# EAGLE schematic rt1_handle (EAGLE 6.6.0)
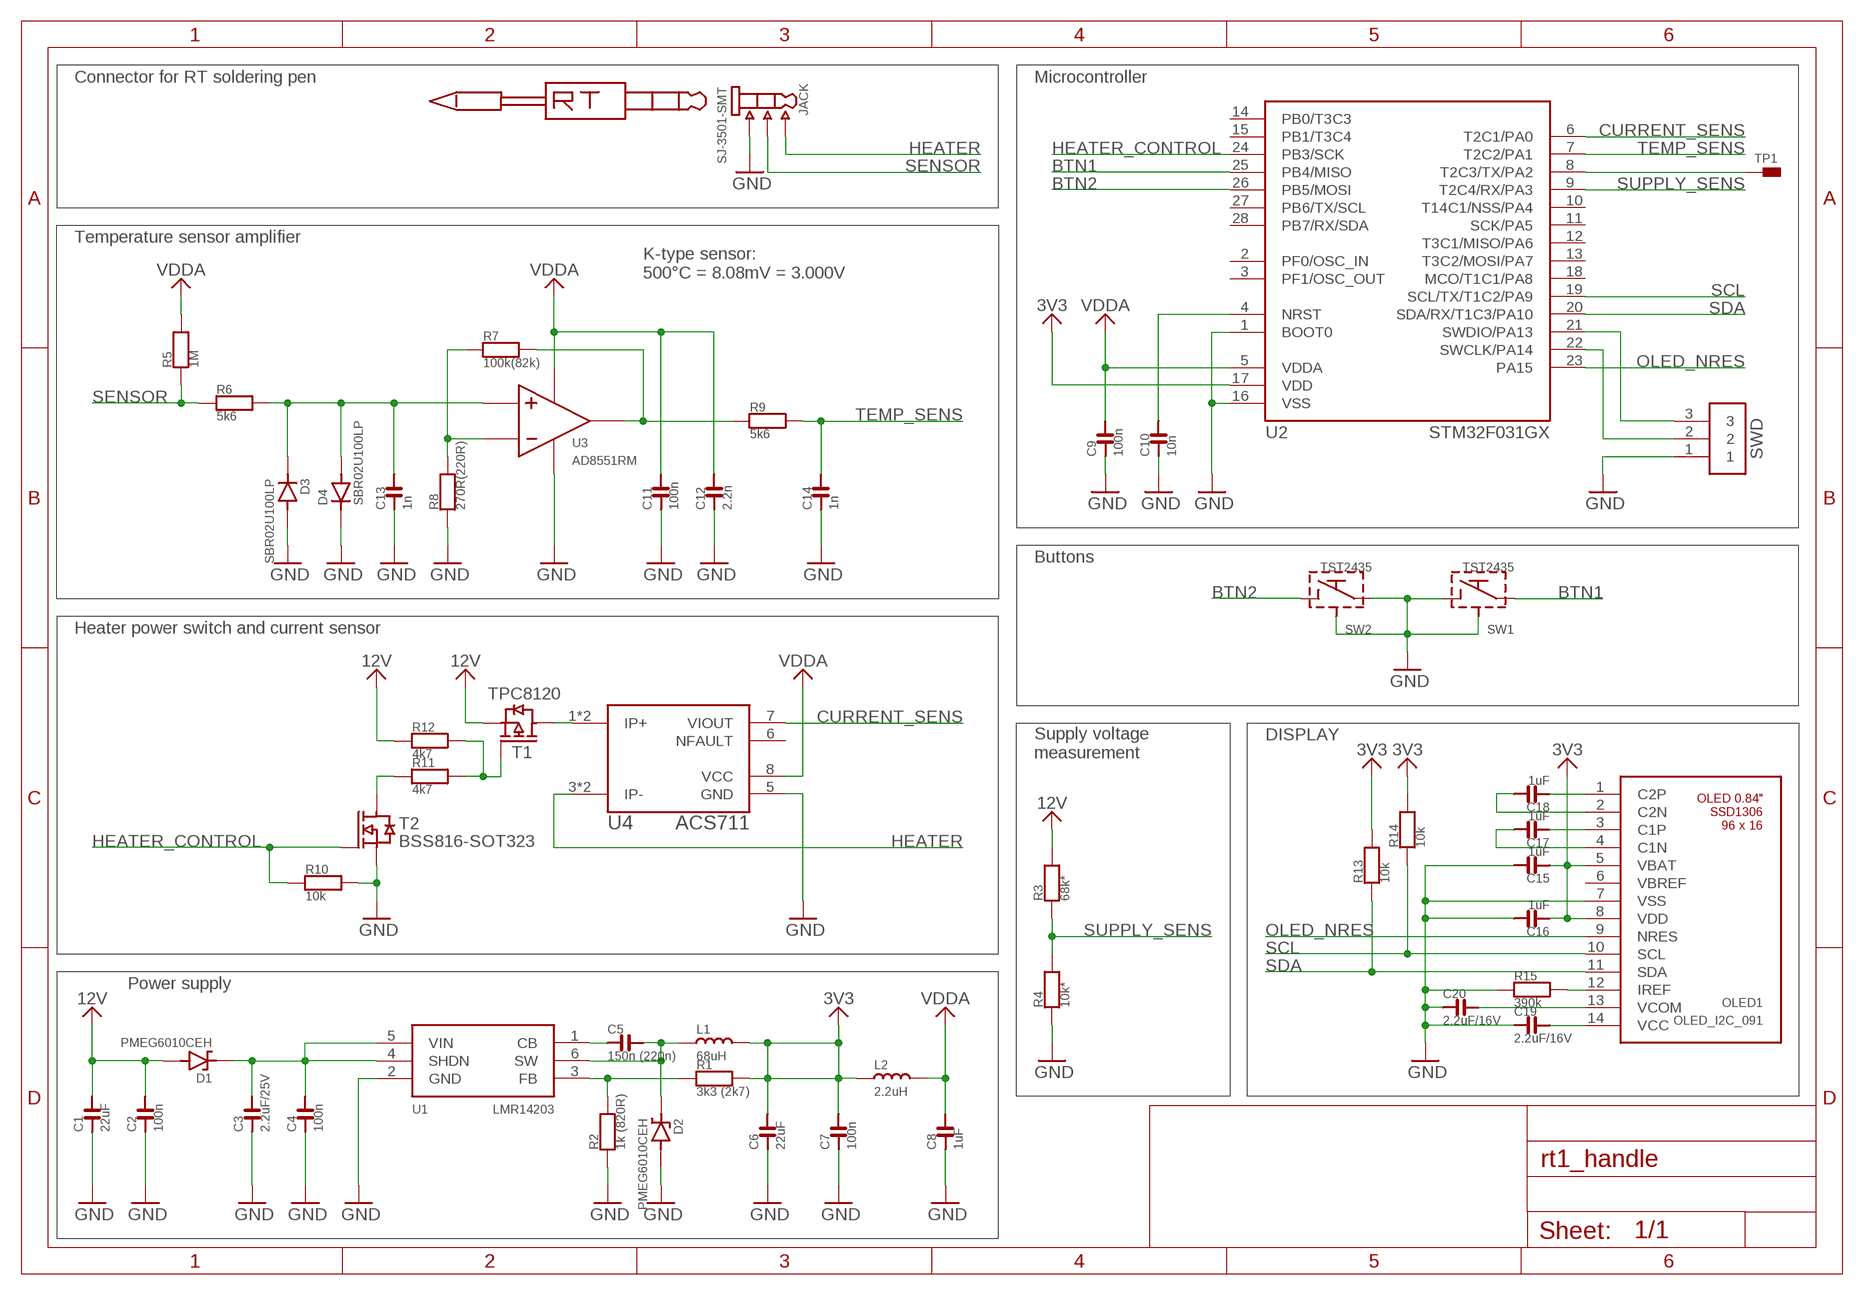
[diagram p0: schematic, sheet 1]

## Parts
C1  22uF  C1206  [1206]
C2  100n  C0402  [0402]
C3  2.2uF/25V  C0805  [0805]
C4  100n  C0402  [0402]
C5  150n (220n)  C0402  [0402]
C6  22uF  C0805  [0805]
C7  100n  C0402  [0402]
C8  1uF  C0603  [0603]
C9  100n  C0402  [0402]
C10  10n  C0402  [0402]
C11  100n  C0402  [0402]
C12  2.2n  C0603  [0603]
C13  1n  C0402  [0402]
C14  1n  C0402  [0402]
C15  1uF  C0603  [0603]
C16  1uF  C0603  [0603]
C17  1uF  C0603  [0603]
C18  1uF  C0603  [0603]
C19  2.2uF/16V  C0603  [0603]
C20  2.2uF/16V  C0603  [0603]
D1  PMEG6010CEH  [SOD123F]
D2  PMEG6010CEH  [SOD123F]
D3  SBR02U100LP  [DFN1006]
D4  SBR02U100LP  [DFN1006]
JACK  SJ-3501-SMT  [SJ-3501-SMT]
L1  68uH  L1717  [1717]
L2  2.2uH  L0805  [0805]
OLED1  OLED_I2C_091  [OLED_I2C_091]
R1  3k3 (2k7)  R0402  [0402]
R2  1k (820R)  R0402  [0402]
R3  68k*  R0402  [0402]
R4  10k*  R0402  [0402]
R5  1M  R0402  [0402]
R6  5k6  R0402  [0402]
R7  100k(82k)  R0402  [0402]
R8  270R(220R)  R0402  [0402]
R9  5k6  R0402  [0402]
R10  10k  R0402  [0402]
R11  4k7  R0402  [0402]
R12  4k7  R0402  [0402]
R13  10k  R0402  [0402]
R14  10k  R0402  [0402]
R15  390k  R0402  [0402]
RT  RT-1  [RT-1]
SW1  TST2435  [TST2435]
SW2  TST2435  [TST2435]
SWD  PINHEAD1X3X  [PIN1X3]
T1  TPC8120  [SOIC8]
T2  BSS816-SOT323  IRLML2502  [SOT23]
TP1  TEST_PAD15X60  [SMD_15_60]
U1  LMR14203  [SOT23-6]
U2  STM32F031GX  [UFQFPN28]
U3  AD8551RM  [MSOP8]
U4  ACS711  [SOIC8]

## Nets
3V3: C6.2 C7.2 C15.1 C16.1 L1.2 L2.1 OLED1.5(VBAT) OLED1.8(VDD) R1.2 R13.2 R14.2 U2.17(VDD)
12V: C1.2 C2.2 D1.A R3.2 R12.1 T1.1(S) T1.2(S) T1.3(S)
12V_DC: C3.2 C4.2 D1.C U1.4(SHDN) U1.5(VIN)
BTN1: SW1.1 U2.25(PB4/MISO)
BTN2: SW2.2 U2.26(PB5/MOSI)
C1N: C17.2 OLED1.4(C1N)
C1P: C17.1 OLED1.3(C1P)
C2N: C18.2 OLED1.2(C2N)
C2P: C18.1 OLED1.1(C2P)
CURRENT_SENS: U2.6(T2C1/PA0) U4.7(VIOUT)
DEBUG_OUT: TP1.TP U2.8(T2C3/TX/PA2)
GND: C1.1 C2.1 C3.1 C4.1 C6.1 C7.1 C8.1 C9.1 C10.1 C11.1 C12.1 C13.1 C14.1 C15.2 C16.2 C19.1 C20.1 D2.A D3.A D4.C JACK.1 JACK.5 OLED1.7(VSS) R2.1 R4.1 R8.1 R10.2 R15.1 SW1.2 SW1.EP1(SHIELD) SW1.EP2(SHIELD) SW2.1 SW2.EP1(SHIELD) SW2.EP2(SHIELD) SWD.1 T2.2(S) U1.2(GND) U2.1(BOOT0) U2.16(VSS) U3.4(V-) U4.5(GND)
HEATER: JACK.2 JACK.4 U4.3(IP-) U4.4(IP-)
HEATER_CONTROL: R10.1 T2.1(G) U2.24(PB3/SCK)
HEATER_PWR: T1.5(D) T1.6(D) T1.7(D) T1.8(D) U4.1(IP+) U4.2(IP+)
IREF: OLED1.12(IREF) R15.2
NRST: C10.2 U2.4(NRST)
OLED_NRES: OLED1.9(NRES) U2.23(PA15)
POWER_SWITCH: R11.2 R12.2 T1.4(G)
POWER_SWITCH_LOW: R11.1 T2.3(D)
SCL: OLED1.10(SCL) R14.1 U2.19(SCL/TX/T1C2/PA9)
SDA: OLED1.11(SDA) R13.1 U2.20(SDA/RX/T1C3/PA10)
SENSOR: JACK.3 R5.1 R6.1
SENSOR_FEEDBACK: R7.1 R8.2 U3.2(IN-)
SENSOR_IN: C13.2 D3.C D4.A R6.2 U3.3(IN+)
SENSOR_OUT: R7.2 R9.1 U3.6(OUT)
SUPPLY_CB: C5.1 U1.1(CB)
SUPPLY_FB: R1.1 R2.2 U1.3(FB)
SUPPLY_SENS: R3.1 R4.2 U2.9(T2C4/RX/PA3)
SWDCLK: SWD.2 U2.22(SWCLK/PA14)
SWDIO: SWD.3 U2.21(SWDIO/PA13)
SWOUT: C5.2 D2.C L1.1 U1.6(SW)
TEMP_SENS: C14.2 R9.2 U2.7(T2C2/PA1)
VCC: C19.2 OLED1.14(VCC)
VCOM: C20.2 OLED1.13(VCOM)
VDDA: C8.2 C9.2 C11.2 C12.2 L2.2 R5.2 U2.5(VDDA) U3.7(V+) U4.8(VCC)
Unconnected: OLED1.6(VBREF) U2.2(PF0/OSC_IN) U2.3(PF1/OSC_OUT) U2.10(T14C1/NSS/PA4) U2.11(SCK/PA5) U2.12(T3C1/MISO/PA6) U2.13(T3C2/MOSI/PA7) U2.14(PB0/T3C3) U2.15(PB1/T3C4) U2.18(MCO/T1C1/PA8) U2.27(PB6/TX/SCL) U2.28(PB7/RX/SDA) U4.6(NFAULT)

## Notes on the sheet
- Connector for RT soldering pen | Microcontroller
- Temperature sensor amplifier
- K-type sensor:
  500°C = 8.08mV = 3.000V
- SWD
- Buttons
- Heater power switch and current sensor
- DISPLAY
- Supply voltage
  measurement
- Power supply

## Library data of the parts
C1-C20 = rlc:C
D1 D2 = diode:PMEG6010
D3 D4 = diode:SBR02U100LP
JACK = jack:SJ-3501-SMT
L1 L2 = rlc:L
OLED1 = oled:OLED_I2C
R1-R15 = rlc:R
RT = weller_rt:RT-1
SW1 SW2 = buttons:TST2435
SWD = pinhead:PINHEAD1X3
T1 = mosfet:TPC8120
T2 = mosfet:IRLML2502
TP1 = test_point:TEST_PAD
U1 = ti:LMR14203
U2 = stm32:STM32F031GX
U3 = analog_devices:AD8551
U4 = allegro:ACS711